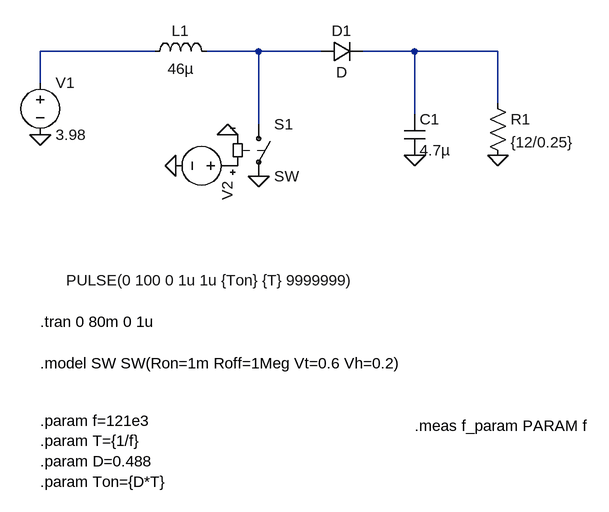
[diagram p0: schematic BoostConverter.asc]
BoostConverter.asc, the LTspice schematic file:
Version 4.1
SHEET 1 880 836
WIRE 96 144 -80 144
WIRE 256 144 176 144
WIRE 352 144 256 144
WIRE 496 144 416 144
WIRE 624 144 496 144
WIRE -80 192 -80 144
WIRE 624 224 624 144
WIRE 496 240 496 144
WIRE 256 256 256 144
FLAG 128 320 0
FLAG 208 272 0
FLAG -80 272 0
FLAG 624 304 0
FLAG 496 304 0
FLAG 256 336 0
SYMBOL ind 80 160 R270
WINDOW 0 32 56 VTop 2
WINDOW 3 5 56 VBottom 2
SYMATTR InstName L1
SYMATTR Value 46µ
SYMATTR SpiceLine Rser=1m
SYMBOL diode 352 160 R270
WINDOW 0 32 32 VTop 2
WINDOW 3 0 32 VBottom 2
SYMATTR InstName D1
SYMBOL voltage -80 176 R0
WINDOW 123 0 0 Left 0
WINDOW 39 0 0 Left 0
SYMATTR InstName V1
SYMATTR Value 3.98
SYMBOL res 608 208 R0
SYMATTR InstName R1
SYMATTR Value {12/0.25}
SYMBOL sw 256 240 R0
SYMATTR InstName S1
SYMBOL voltage 224 320 R90
WINDOW 3 176 -184 VRight 2
WINDOW 123 0 0 Left 0
WINDOW 39 0 0 Left 0
SYMATTR Value PULSE(0 100 0 1u 1u {Ton} {T} 9999999)
SYMATTR InstName V2
SYMBOL cap 480 240 R0
SYMATTR InstName C1
SYMATTR Value 4.7µ
TEXT -80 624 Left 2 !.model SW SW(Ron=1m Roff=1Meg Vt=0.6 Vh=0.2)
TEXT -80 712 Left 2 !.param f=121e3\n.param T={1/f}\n.param D=0.488\n.param Ton={D*T}
TEXT 496 720 Left 2 !.meas f_param PARAM f
TEXT -80 560 Left 2 !.tran 0 80m 0 1u

The netlist it stands for:
* BoostConverter.asc
L1 N001 N002 46µ Rser=1m
D1 N002 N003 D
V1 N001 0 3.98
R1 N003 0 {12/0.25}
S1 N002 0 P001 0 SW
V2 P001 0 PULSE(0 100 0 1u 1u {Ton} {T} 9999999)
C1 N003 0 4.7µ
.model D D
.lib standard.dio
.model SW SW(Ron=1m Roff=1Meg Vt=0.6 Vh=0.2)
.param f=121e3
.param T={1/f}
.param D=0.488
.param Ton={D*T}
.meas f_param PARAM f
.tran 0 80m 0 1u
.backanno
.end